# Altium schematic sheet FPGA_Bank_IO.SchDoc
size A4; SheetNumber: 8; SheetTotal: 14
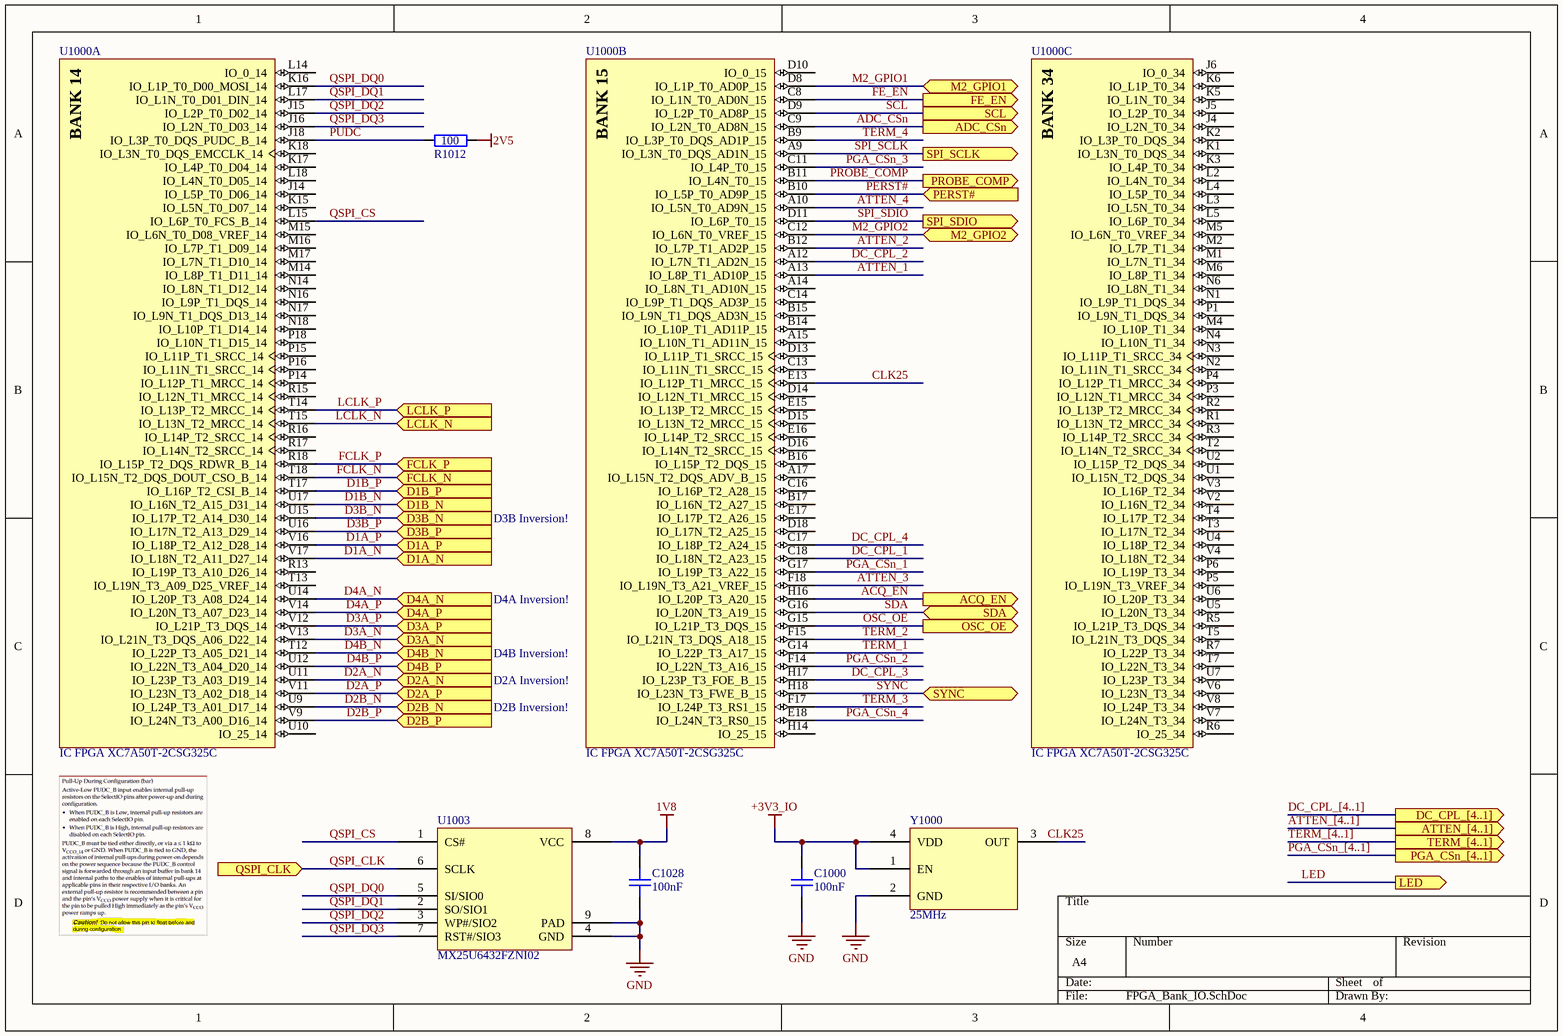
[diagram p0: FPGA_Bank_IO.SchDoc]

## Parts
C1000  100nF  [GEN_C_0402]
C1028  100nF  [GEN_C_0402]
R1012  100  [GEN_R_0402]
U1000  IC FPGA XC7A50T-2CSG325C  [XILINX_XC7A50T-2CSG325C]  (parts A,B,C of 9)
U1003  MX25U6432FZNI02  [MX_WSON8]
Y1000  25MHz  [ECS_TXO-2016]

## Ports
ACQ_EN (out), ADC_CSn (out), ATTEN_[4..1] (out), D1A_N (in), D1A_P (in), D1B_N (in), D1B_P (in), D2A_N (in), D2A_P (in), D2B_N (in), D2B_P (in), D3A_N (in), D3A_P (in), D3B_N (in), D3B_P (in), D4A_N (in), D4A_P (in), D4B_N (in), D4B_P (in), DC_CPL_[4..1] (out), FCLK_N (in), FCLK_P (in), FE_EN (out), LCLK_N (in), LCLK_P (in), LED (out), M2_GPIO1 (bidir), M2_GPIO2 (bidir), OSC_OE (out), PERST# (in), PGA_CSn_[4..1] (out), PROBE_COMP (out), QSPI_CLK (in), SCL (out), SDA (bidir), SPI_SCLK (out), SPI_SDIO (out), SYNC (bidir), TERM_[4..1] (out)

## Nets
1V8: C1028.1 U1003.8(VCC)
2V5: R1012.2
+3V3_IO: C1000.1 Y1000.1(EN) Y1000.4(VDD)
GND: C1000.2 C1028.2 U1003.4(GND) U1003.9(PAD) Y1000.2(GND)
ACQ_EN: U1000.H16(IO_L20P_T3_A20_15) ; port ACQ_EN
ADC_CSn: U1000.C9(IO_L2N_T0_AD8N_15) ; port ADC_CSn
ATTEN_1: U1000.A13(IO_L8P_T1_AD10P_15)
ATTEN_2: U1000.B12(IO_L7P_T1_AD2P_15)
ATTEN_3: U1000.F18(IO_L19N_T3_A21_VREF_15)
ATTEN_4: U1000.A10(IO_L5N_T0_AD9N_15)
CLK25: U1000.E13(IO_L12P_T1_MRCC_15) Y1000.3(OUT)
D1A_N: U1000.V17(IO_L18N_T2_A11_D27_14) ; port D1A_N
D1A_P: U1000.V16(IO_L18P_T2_A12_D28_14) ; port D1A_P
D1B_N: U1000.U17(IO_L16N_T2_A15_D31_14) ; port D1B_N
D1B_P: U1000.T17(IO_L16P_T2_CSI_B_14) ; port D1B_P
D2A_N: U1000.U11(IO_L23P_T3_A03_D19_14) ; port D2A_N
D2A_P: U1000.V11(IO_L23N_T3_A02_D18_14) ; port D2A_P
D2B_N: U1000.U9(IO_L24P_T3_A01_D17_14) ; port D2B_N
D2B_P: U1000.V9(IO_L24N_T3_A00_D16_14) ; port D2B_P
D3A_N: U1000.V13(IO_L21N_T3_DQS_A06_D22_14) ; port D3A_N
D3A_P: U1000.V12(IO_L21P_T3_DQS_14) ; port D3A_P
D3B_N: U1000.U15(IO_L17P_T2_A14_D30_14) ; port D3B_N
D3B_P: U1000.U16(IO_L17N_T2_A13_D29_14) ; port D3B_P
D4A_N: U1000.U14(IO_L20P_T3_A08_D24_14) ; port D4A_N
D4A_P: U1000.V14(IO_L20N_T3_A07_D23_14) ; port D4A_P
D4B_N: U1000.T12(IO_L22P_T3_A05_D21_14) ; port D4B_N
D4B_P: U1000.U12(IO_L22N_T3_A04_D20_14) ; port D4B_P
DC_CPL_1: U1000.C18(IO_L18N_T2_A23_15)
DC_CPL_2: U1000.A12(IO_L7N_T1_AD2N_15)
DC_CPL_3: U1000.H17(IO_L23P_T3_FOE_B_15)
DC_CPL_4: U1000.C17(IO_L18P_T2_A24_15)
FCLK_N: U1000.T18(IO_L15N_T2_DQS_DOUT_CSO_B_14) ; port FCLK_N
FCLK_P: U1000.R18(IO_L15P_T2_DQS_RDWR_B_14) ; port FCLK_P
FE_EN: U1000.C8(IO_L1N_T0_AD0N_15) ; port FE_EN
LCLK_N: U1000.T15(IO_L13N_T2_MRCC_14) ; port LCLK_N
LCLK_P: U1000.T14(IO_L13P_T2_MRCC_14) ; port LCLK_P
LED: port LED
M2_GPIO1: U1000.D8(IO_L1P_T0_AD0P_15) ; port M2_GPIO1
M2_GPIO2: U1000.C12(IO_L6N_T0_VREF_15) ; port M2_GPIO2
OSC_OE: U1000.G15(IO_L21P_T3_DQS_15) ; port OSC_OE
PERST#: U1000.B10(IO_L5P_T0_AD9P_15) ; port PERST#
PGA_CSn_1: U1000.G17(IO_L19P_T3_A22_15)
PGA_CSn_2: U1000.F14(IO_L22N_T3_A16_15)
PGA_CSn_3: U1000.C11(IO_L4P_T0_15)
PGA_CSn_4: U1000.E18(IO_L24N_T3_RS0_15)
PROBE_COMP: U1000.B11(IO_L4N_T0_15) ; port PROBE_COMP
PUDC: R1012.1 U1000.J18(IO_L3P_T0_DQS_PUDC_B_14)
QSPI_CLK: U1003.6(SCLK) ; port QSPI_CLK
QSPI_CS: U1000.L15(IO_L6P_T0_FCS_B_14) U1003.1(CS#)
QSPI_DQ0: U1000.K16(IO_L1P_T0_D00_MOSI_14) U1003.5(SI/SIO0)
QSPI_DQ1: U1000.L17(IO_L1N_T0_D01_DIN_14) U1003.2(SO/SIO1)
QSPI_DQ2: U1000.J15(IO_L2P_T0_D02_14) U1003.3(WP#/SIO2)
QSPI_DQ3: U1000.J16(IO_L2N_T0_D03_14) U1003.7(RST#/SIO3)
SCL: U1000.D9(IO_L2P_T0_AD8P_15) ; port SCL
SDA: U1000.G16(IO_L20N_T3_A19_15) ; port SDA
SPI_SCLK: U1000.A9(IO_L3N_T0_DQS_AD1N_15) ; port SPI_SCLK
SPI_SDIO: U1000.D11(IO_L6P_T0_15) ; port SPI_SDIO
SYNC: U1000.H18(IO_L23N_T3_FWE_B_15) ; port SYNC
TERM_1: U1000.G14(IO_L22P_T3_A17_15)
TERM_2: U1000.F15(IO_L21N_T3_DQS_A18_15)
TERM_3: U1000.F17(IO_L24P_T3_RS1_15)
TERM_4: U1000.B9(IO_L3P_T0_DQS_AD1P_15)

Not connected (* = marked no-connect by the designer): U1000 A14(IO_L8N_T1_AD10N_15) A15(IO_L10N_T1_AD11N_15) A17(IO_L15N_T2_DQS_ADV_B_15) B14(IO_L10P_T1_AD11P_15) B15(IO_L9N_T1_DQS_AD3N_15) B16(IO_L15P_T2_DQS_15) B17(IO_L16N_T2_A27_15) C13(IO_L11N_T1_SRCC_15) C14(IO_L9P_T1_DQS_AD3P_15) C16(IO_L16P_T2_A28_15) D10(IO_0_15) D13(IO_L11P_T1_SRCC_15) D14(IO_L12N_T1_MRCC_15) D15(IO_L13N_T2_MRCC_15) D16(IO_L14N_T2_SRCC_15) D18(IO_L17N_T2_A25_15) E15(IO_L13P_T2_MRCC_15) E16(IO_L14P_T2_SRCC_15) E17(IO_L17P_T2_A26_15) H14(IO_25_15) J4(IO_L2N_T0_34) J5(IO_L2P_T0_34) J6(IO_0_34) J14(IO_L5P_T0_D06_14) K1(IO_L3N_T0_DQS_34) K2(IO_L3P_T0_DQS_34) K3(IO_L4P_T0_34) K5(IO_L1N_T0_34) K6(IO_L1P_T0_34) K15(IO_L5N_T0_D07_14) K17(IO_L4P_T0_D04_14) K18(IO_L3N_T0_DQS_EMCCLK_14) L2(IO_L4N_T0_34) L3(IO_L5N_T0_34) L4(IO_L5P_T0_34) L5(IO_L6P_T0_34) L14(IO_0_14) L18(IO_L4N_T0_D05_14) M1(IO_L7N_T1_34) M2(IO_L7P_T1_34) M4(IO_L10P_T1_34) M5(IO_L6N_T0_VREF_34) M6(IO_L8P_T1_34) M14(IO_L8P_T1_D11_14) M15(IO_L6N_T0_D08_VREF_14) M16(IO_L7P_T1_D09_14) M17(IO_L7N_T1_D10_14) N1(IO_L9P_T1_DQS_34) N2(IO_L11N_T1_SRCC_34) N3(IO_L11P_T1_SRCC_34) N4(IO_L10N_T1_34) N6(IO_L8N_T1_34) N14(IO_L8N_T1_D12_14) N16(IO_L9P_T1_DQS_14) N17(IO_L9N_T1_DQS_D13_14) N18(IO_L10P_T1_D14_14) P1(IO_L9N_T1_DQS_34) P3(IO_L12N_T1_MRCC_34) P4(IO_L12P_T1_MRCC_34) P5(IO_L19N_T3_VREF_34) P6(IO_L19P_T3_34) P14(IO_L12P_T1_MRCC_14) P15(IO_L11P_T1_SRCC_14) P16(IO_L11N_T1_SRCC_14) P18(IO_L10N_T1_D15_14) R1(IO_L13N_T2_MRCC_34) R2(IO_L13P_T2_MRCC_34) R3(IO_L14P_T2_SRCC_34) R5(IO_L21P_T3_DQS_34) R6(IO_25_34) R7(IO_L22P_T3_34) R13(IO_L19P_T3_A10_D26_14) R15(IO_L12N_T1_MRCC_14) R16(IO_L14P_T2_SRCC_14) R17(IO_L14N_T2_SRCC_14) T2(IO_L14N_T2_SRCC_34) T3(IO_L17N_T2_34) T4(IO_L17P_T2_34) T5(IO_L21N_T3_DQS_34) T7(IO_L22N_T3_34) T13(IO_L19N_T3_A09_D25_VREF_14) U1(IO_L15N_T2_DQS_34) U2(IO_L15P_T2_DQS_34) U4(IO_L18P_T2_34) U5(IO_L20N_T3_34) U6(IO_L20P_T3_34) U7(IO_L23P_T3_34) U10(IO_25_14) V2(IO_L16N_T2_34) V3(IO_L16P_T2_34) V4(IO_L18N_T2_34) V6(IO_L23N_T3_34) V7(IO_L24N_T3_34) V8(IO_L24P_T3_34)

## Buses and harness runs
bus ATTEN_[4..1] = port ATTEN_[4..1]
bus DC_CPL_[4..1] = port DC_CPL_[4..1]
bus PGA_CSn_[4..1] = port PGA_CSn_[4..1]
bus TERM_[4..1] = port TERM_[4..1]

## Notes on the sheet
- D3B Inversion!
- D4B Inversion!
- D4A Inversion!
- D2B Inversion!
- D2A Inversion!
- (in symbol IC FPGA XC7A50T-2CSG325C, part A) BANK 14
- (in symbol IC FPGA XC7A50T-2CSG325C, part B) BANK 15
- (in symbol IC FPGA XC7A50T-2CSG325C, part C) BANK 34

## Library data of the parts
C1000 C1028 = CAP 100nF 16V X7R 0402: House Part Number: C-100nF-0402-002; Manufacturer: Murata; Manufacturer Part Number: GCM155R71C104KA55D; Voltage Rating: 16V; Package: 0402; Supplier 1: Mouser; Supplier Part Number 1: 81-GCM155R71C104KA5D; Value: 100nF
R1012 = RES 100 OHM 1% 1/10W 0402: Manufacturer: Yageo; Manufacturer Part Number: RC0402FR-07100RL; Tolerance: 1%; Package: 0402; Value: 100; Supplier 1: Mouser; Supplier Part Number 1: 603-RC0402FR-07100RL
U1000 = IC FPGA XC7A50T-2CSG325C: Artix-7 FPGA, 150 User I/Os, 4 GTP, 324-Ball BGA, Speed Grade 2, Commercial Grade, Pb-Free; Manufacturer: Xilinx; House Part Number: XC7A50T-2CSG325C; Manufacturer Part Number: XC7A50T-2CSG325C; Supplier 1: Digi-Key; Supplier Part Number 1: 122-2193-ND
U1003 = IC FLASH MX25U6432FZNI02: Manufacturer: Macronix; Supplier 1: Digi-Key; Supplier Part Number 1: 1092-MX25U6432FZNI02-ND; House Part Number: MX25U6432FZNI02; Manufacturer Part Number: MX25U6432FZNI02
Y1000 = OSC 25MHz ECS-TXO-2016: House Part Number: ECS-TXO-2016-33-250-TR; Manufacturer: ECS International; Supplier 1: Mouser; Supplier Part Number 1: 520-TXO-2016-33-250T; Manufacturer Part Number: ECS-TXO-2016-33-250-TR